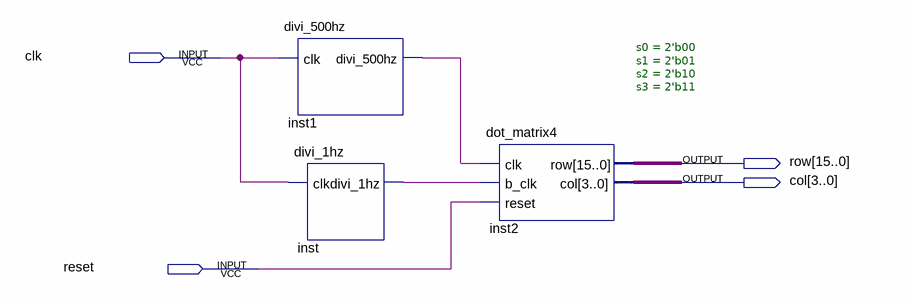
[diagram p0: schematic sheet]
// Quartus schematic dot_ma4.bdf as structural Verilog: 3 symbols, 4 pins
module dot_ma4 (
  input  clk,
  input  reset,
  output [15:0] row,
  output [3:0] col
);

  wire inst1_divi_500hz, inst_divi_1hz;

  divi_500hz inst1 (.clk(clk), .divi_500hz(inst1_divi_500hz));
  divi_1hz inst (.clk(clk), .divi_1hz(inst_divi_1hz));
  dot_matrix4 #(.s0(2'b00), .s1(2'b01), .s2(2'b10), .s3(2'b11)) inst2 (
    .clk(inst1_divi_500hz), .b_clk(inst_divi_1hz), .reset(reset), .row(row), .col(col));
endmodule
